# Altium schematic sheet 09_eMMC_Flash.SchDoc: eMMC_Flash
size 420 x 297 mm; Author: Lukas Henkel; DocumentNumber: 9; SheetNumber: 9; SheetTotal: 16; DocSize: A3
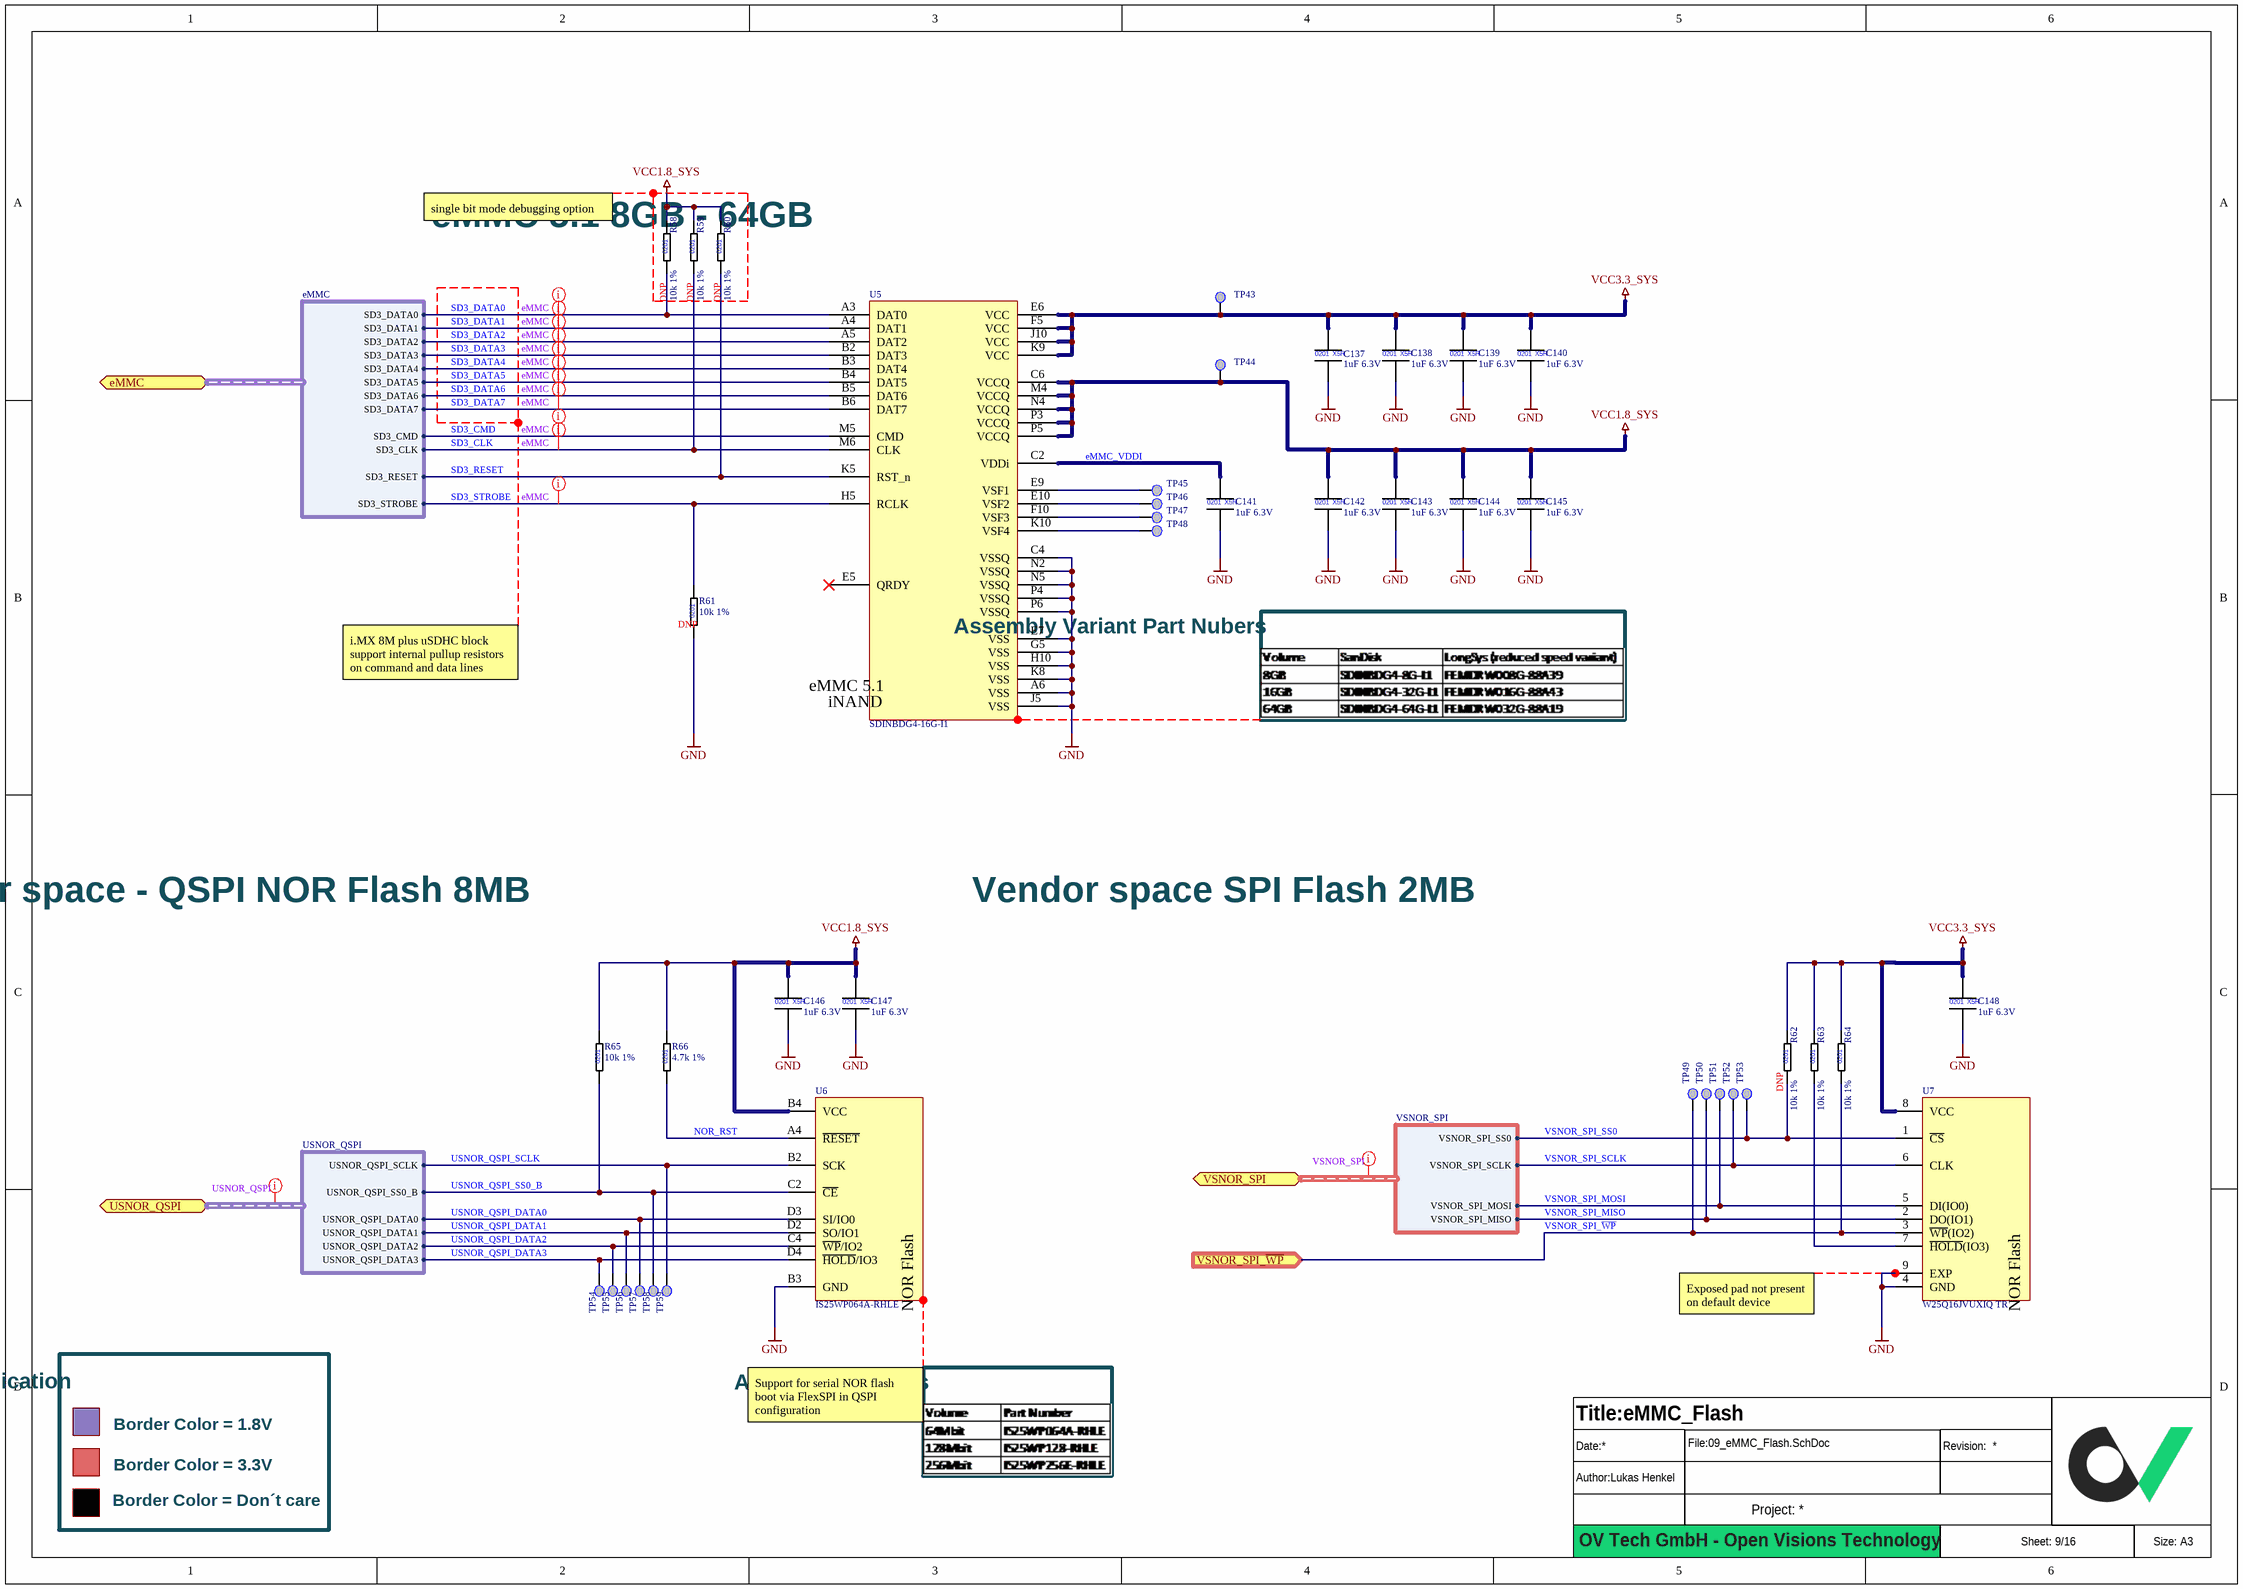
[diagram p0: 09_eMMC_Flash.SchDoc]

## Parts
?  (no value)  (graphical)
C137  1uF 6.3V  [CAPC0603X03L]
C138  1uF 6.3V  [CAPC0603X03L]
C139  1uF 6.3V  [CAPC0603X03L]
C140  1uF 6.3V  [CAPC0603X03L]
C141  1uF 6.3V  [CAPC0603X03L]
C142  1uF 6.3V  [CAPC0603X03L]
C143  1uF 6.3V  [CAPC0603X03L]
C144  1uF 6.3V  [CAPC0603X03L]
C145  1uF 6.3V  [CAPC0603X03L]
C146  1uF 6.3V  [CAPC0603X03L]
C147  1uF 6.3V  [CAPC0603X03L]
C148  1uF 6.3V  [CAPC0603X03L]
R58  10k 1%  [RESC0603X03L]  (no BOM)
R59  10k 1%  [RESC0603X03L]  (no BOM)
R60  10k 1%  [RESC0603X03L]
R61  10k 1%  [RESC0603X03L]  (no BOM)
R62  10k 1%  [RESC0603X03L]
R63  10k 1%  [RESC0603X03L]
R64  10k 1%  [RESC0603X03L]
R65  10k 1%  [RESC0603X03L]
R66  4.7k 1%  [RESC0603X03L]
TP43  Testpoint 0.5mm  [TP_0.50mm]  (value not drawn)  (no BOM)
TP44  Testpoint 0.5mm  [TP_0.50mm]  (value not drawn)  (no BOM)
TP45  Testpoint 0.5mm  [TP_0.50mm]  (value not drawn)  (no BOM)
TP46  Testpoint 0.5mm  [TP_0.50mm]  (value not drawn)  (no BOM)
TP47  Testpoint 0.5mm  [TP_0.50mm]  (value not drawn)  (no BOM)
TP48  Testpoint 0.5mm  [TP_0.50mm]  (value not drawn)  (no BOM)
TP49  Testpoint 0.5mm  [TP_0.50mm]  (value not drawn)  (no BOM)
TP50  Testpoint 0.5mm  [TP_0.50mm]  (value not drawn)  (no BOM)
TP51  Testpoint 0.5mm  [TP_0.50mm]  (value not drawn)  (no BOM)
TP52  Testpoint 0.5mm  [TP_0.50mm]  (value not drawn)  (no BOM)
TP53  Testpoint 0.5mm  [TP_0.50mm]  (value not drawn)  (no BOM)
TP54  Testpoint 0.5mm  [TP_0.50mm]  (value not drawn)  (no BOM)
TP55  Testpoint 0.5mm  [TP_0.50mm]  (value not drawn)  (no BOM)
TP56  Testpoint 0.5mm  [TP_0.50mm]  (value not drawn)  (no BOM)
TP57  Testpoint 0.5mm  [TP_0.50mm]  (value not drawn)  (no BOM)
TP58  Testpoint 0.5mm  [TP_0.50mm]  (value not drawn)  (no BOM)
TP59  Testpoint 0.5mm  [TP_0.50mm]  (value not drawn)  (no BOM)
U5  SDINBDG4-16G-I1  [BGA153C50P14X14_1150X1300X80]
U6  IS25WP064A-RHLE  [BGA24C100P5X5_600X800X120]
U7  W25Q16JVUXIQ TR  [QFN50P300X200X60_HS-9L]

## Ports
eMMC (bidir, harness eMMC), USNOR_QSPI (bidir, harness USNOR_QSPI), VSNOR_SPI (bidir, harness VSNOR_SPI), VSNOR_SPI_~{WP} (in)

## Harnesses
eMMC: SD3_STROBE, SD3_CLK, SD3_CMD, SD3_DATA0, SD3_DATA1, SD3_DATA2, SD3_DATA3, SD3_DATA4, SD3_DATA5, SD3_DATA6, SD3_DATA7, SD3_RESET
USNOR_QSPI: USNOR_QSPI_SCLK, USNOR_QSPI_SS0_B, USNOR_QSPI_DATA0, USNOR_QSPI_DATA1, USNOR_QSPI_DATA2, USNOR_QSPI_DATA3
VSNOR_SPI: VSNOR_SPI_SS0, VSNOR_SPI_SCLK, VSNOR_SPI_MOSI, VSNOR_SPI_MISO

## Nets
GND: C137.2 C138.2 C139.2 C140.2 C141.2 C142.2 C143.2 C144.2 C145.2 C146.2 C147.2 C148.2 R61.1 U5.A6(VSS) U5.C4(VSSQ) U5.E7(VSS) U5.G5(VSS) U5.H10(VSS) U5.J5(VSS) U5.K8(VSS) U5.N2(VSSQ) U5.N5(VSSQ) U5.P4(VSSQ) U5.P6(VSSQ) U6.B3(GND) U7.4(GND) U7.9(EXP)
VCC1.8_SYS: C142.1 C143.1 C144.1 C145.1 C146.1 C147.1 R58.2 R59.2 R60.2 R65.2 R66.2 TP44.TP U5.C6(VCCQ) U5.M4(VCCQ) U5.N4(VCCQ) U5.P3(VCCQ) U5.P5(VCCQ) U6.B4(VCC)
VCC3.3_SYS: C137.1 C138.1 C139.1 C140.1 C148.1 R62.2 R63.2 R64.2 TP43.TP U5.E6(VCC) U5.F5(VCC) U5.J10(VCC) U5.K9(VCC) U7.8(VCC)
eMMC_VDDI: C141.1 U5.C2(VDDi)
NOR_RST: R66.1 U6.A4(~{RESET})
SD3_CLK: R59.1 U5.M6(CLK) ; port eMMC.SD3_CLK
SD3_CMD: U5.M5(CMD) ; port eMMC.SD3_CMD
SD3_DATA0: R58.1 U5.A3(DAT0) ; port eMMC.SD3_DATA0
SD3_DATA1: U5.A4(DAT1) ; port eMMC.SD3_DATA1
SD3_DATA2: U5.A5(DAT2) ; port eMMC.SD3_DATA2
SD3_DATA3: U5.B2(DAT3) ; port eMMC.SD3_DATA3
SD3_DATA4: U5.B3(DAT4) ; port eMMC.SD3_DATA4
SD3_DATA5: U5.B4(DAT5) ; port eMMC.SD3_DATA5
SD3_DATA6: U5.B5(DAT6) ; port eMMC.SD3_DATA6
SD3_DATA7: U5.B6(DAT7) ; port eMMC.SD3_DATA7
SD3_RESET: R60.1 U5.K5(RST_n) ; port eMMC.SD3_RESET
SD3_STROBE: R61.2 U5.H5(RCLK) ; port eMMC.SD3_STROBE
USNOR_QSPI_DATA0: TP57.TP U6.D3(SI/IO0) ; port USNOR_QSPI.USNOR_QSPI_DATA0
USNOR_QSPI_DATA1: TP56.TP U6.D2(SO/IO1) ; port USNOR_QSPI.USNOR_QSPI_DATA1
USNOR_QSPI_DATA2: TP55.TP U6.C4(~{WP}/IO2) ; port USNOR_QSPI.USNOR_QSPI_DATA2
USNOR_QSPI_DATA3: TP54.TP U6.D4(~{HOLD}/IO3) ; port USNOR_QSPI.USNOR_QSPI_DATA3
USNOR_QSPI_SCLK: TP59.TP U6.B2(SCK) ; port USNOR_QSPI.USNOR_QSPI_SCLK
USNOR_QSPI_SS0_B: R65.1 TP58.TP U6.C2(~{CE}) ; port USNOR_QSPI.USNOR_QSPI_SS0_B
VSNOR_SPI_MISO: TP50.TP U7.2(DO(IO1)) ; port VSNOR_SPI.VSNOR_SPI_MISO
VSNOR_SPI_MOSI: TP51.TP U7.5(DI(IO0)) ; port VSNOR_SPI.VSNOR_SPI_MOSI
VSNOR_SPI_SCLK: TP52.TP U7.6(CLK) ; port VSNOR_SPI.VSNOR_SPI_SCLK
VSNOR_SPI_SS0: R62.1 TP53.TP U7.1(~{CS}) ; port VSNOR_SPI.VSNOR_SPI_SS0
VSNOR_SPI_~{WP}: R64.1 TP49.TP U7.3(~{WP}(IO2)) ; port VSNOR_SPI_~{WP}
NetR63_1: R63.1 U7.7(~{HOLD}(IO3))
NetTP45_TP: TP45.TP U5.E9(VSF1)
NetTP46_TP: TP46.TP U5.E10(VSF2)
NetTP47_TP: TP47.TP U5.F10(VSF3)
NetTP48_TP: TP48.TP U5.K10(VSF4)

Not connected (* = marked no-connect by the designer): U5 E5(QRDY)*

## Layout directives
net class eMMC: SD3_CLK, SD3_CMD, SD3_DATA0, SD3_DATA1, SD3_DATA2, SD3_DATA3, SD3_DATA4, SD3_DATA5, SD3_DATA6, SD3_DATA7, SD3_STROBE
net class USNOR_QSPI: (no net found under the mark)
net class VSNOR_SPI: (no net found under the mark)

## Notes on the sheet
- eMMC 5.1 8GB - 64GB
- single bit mode debugging option
- (near R58) DNP
- (near R59) DNP
- (near R60) DNP
- (near R61) DNP
- Assembly Variant Part Nubers
- i.MX 8M plus uSDHC block support internal pullup resistors on command and data lines
- User space - QSPI NOR Flash 8MB
- Vendor space SPI Flash 2MB
- (near R62) DNP
- Exposed pad not present on default device
- Signal Level Indication
- Assembly Variants
- Border Color = 1.8V
- Border Color = 3.3V
- Support for serial NOR flash boot via FlexSPI in QSPI configuration
- Border Color = Don´t care
- OV Tech GmbH - Open Visions Technology
- (in symbol CAP_0201_1uF_6.3V) 0201; X5R
- (in symbol eMMC_SDINBDG4-16G-I1) eMMC 5.1; iNAND
- (in symbol NOR_Flash_IS25WP064A-RHLE) NOR Flash
- (in symbol NOR_Flash_W25Q16) NOR Flash
- (in symbol RES_0201_4.7k_1%) 0201
- (in symbol RES_0201_10k_1%) 0201

## Library data of the parts
? = Titleblock_01_OpenSource
C137-C148 = CAP_0201_1uF_6.3V: Multilayer Ceramic Capacitors MLCC - SMD/SMT 0201 6.3VDC; Manufacturer 1: Murata Electronics; Manufacturer 1 Prt. Nr.: GRM033R60J105MEA2D; Manufacturer 2 Prt. Nr.: CL03A105MQ3CSNC; Manufacturer 2: Samsung Electro-Mechanics
R58-R65 = RES_0201_10k_1%: Thick Film Resistors - SMD 10K OHM 1%; Manufacturer 1: Yageo; Manufacturer 1 Prt. Nr.: RC0201FR-0710KL; Manufacturer 2 Prt. Nr.: CRCW020110K0FNED; Manufacturer 2: Vishay / Dale
R66 = RES_0201_4.7k_1%: Thick Film Resistors - SMD 4.7K OHM 1%; Manufacturer 1: Yageo; Manufacturer 1 Prt. Nr.: RC0201JR-074K7P; Manufacturer 2 Prt. Nr.: CRCW02014K70FNED; Manufacturer 2: Vishay / Dale
U5 = eMMC_SDINBDG4-16G-I1: iNAND eMMC 16GB; Manufacturer 1: SanDisk; Manufacturer 1 Prt. Nr.: SDINBDG4-16G-I1
U6 = NOR_Flash_IS25WP064A-RHLE: NOR Flash 64Mbit; Manufacturer 1: ISSI; Manufacturer 1 Prt. Nr.: IS25WP064A-RHLE
U7 = NOR_Flash_W25Q16: NOR Flash spiFlash, 3V, 16M-bit, 4Kb Uniform Sector, DTR; Manufacturer 1: Winbond; Manufacturer 1 Prt. Nr.: W25Q16JVUXIQ TR; Temperature Range: -40°C - 85°C